# Altium schematic sheet DE11.SchDoc
size A3; SheetNumber: 1; SheetTotal: 1; SPICEModelCacheJDXTLVBZ: <root> / <DocumentId>JDXTLVBZ</DocumentId> / <CacheFrame Number="0"> / <Model Name="diode" Kind="MDL"> / <Text>*Default Diode / *Diode Pinout: A,K / .MODEL DIODE D()</Text> / </Model> / <Model Name="skydiode" Kind="MDL"> / <Text>*Default Schottky Diode / *Schottky Diode Pinout: A,K / .MODEL SKYDIODE D(EG=0.69 XTI=2)</Text> / </Model> / <Model Name="fuse" Kind="CKT"> / <Text>.SUBCKT FUSE 1 2 PARAMS: CURRENT=1 RESISTANCE=1m / SW1 1 2 3 0 SMOD OFF / BNLV 3 0 V=(abs(v(1,2))) / .MODEL SMOD SW (VT={(CURRENT*RESISTANCE)} RON=1g ROFF={RESISTANCE}) / .ENDS FUSE</Text> / </Model> / <Model Name="ideal3w" Kind="CKT"> / <Text>* Ideal Transformer Subcircuit Parameters / * RATIO1 = turns ratio (= secondary1/primary) / * RATIO2 = turns ratio (= secondary2/primary) / * / * Ideal Transformer with three windings / * jjt 18/12/00: created using IDEAL4W (created by dw, 18/12/2000) as a template. / * Connections: / *               Pri+ / *               | Pri- / *               | | Sec1+ / *               | | | Sec1- / *               | | | | Sec2+ / *               | | | | | Sec2- / *               | | | | | | / *               | | | | | | / *               | | | | | | / .SUBCKT IDEAL3W 1 2 3 4 5 6 PARAMS: RATIO1=1 RATIO2=1 / BP  1 2 I=( -I(BS1)*{RATIO1} - I(BS2)*{RATIO2} ) / BS1 3 4 V=( V(1,2)*{RATIO1} ) / BS2 5 6 V=( V(1,2)*{RATIO2} ) / .ENDS IDEAL3W</Text> / </Model> / <Model Name="irf9510" Kind="CKT"> / <Text>*IRF9510  MCE  4-2-96 / *100V  4A  1.2 ohms HEXFET pkg:TO-220 2,1,3 / .SUBCKT IRF9510  10 20 40 40 / M1   1  2  3  3  DMOS L=1U W=1U / RD  10  1  .569 / RS  30  3  31M / RG  20  2  37.5 / CGS  2  3  182P / EGD 12  0  1  2  1 / VFB 14  0  0 / FFB  1  2  VFB  1 / CGD 13 14  231P / R1  13  0  1 / D1  12 13  DLIM / DDG 15 14  DCGD / R2  12 15  1 / D2  15  0  DLIM / DSD 10  3  DSUB / LS  30 40  7.5N / .MODEL DMOS PMOS (LEVEL=3 THETA=60M VMAX=208K ETA=2M VTO=-3 KP=.471) / .MODEL DCGD D (CJO=231P VJ=.6 M=.68) / .MODEL DSUB D (IS=16.6N N=1.5 RS=1.18 BV=100 CJO=327P VJ=.8 M=.42 TT=82N) / .MODEL DLIM D (IS=100U) / .ENDS IRF9510</Text> / </Model> / <Model Name="irf1010" Kind="CKT"> / <Text>*IRF1010 MCE 4-2-96 / *55V  75A .014 ohm HEXFET pkg:TO-220 2,1,3 / .SUBCKT IRF1010  10 20 40 40 / M1   1  2  3  3  DMOS L=1U W=1U / RD  10  1  5.65M / RS  30  3  1.35M / RG  20  2  12.1 / CGS  2  3  2.15N / EGD 12  0  2  1  1 / VFB 14  0  0 / FFB  2  1  VFB  1 / CGD 13 14  4.49N / R1  13  0  1 / D1  12 13  DLIM / DDG 15 14  DCGD / R2  12 15  1 / D2  15  0  DLIM / DSD  3 10  DSUB / LS  30 40  7.5N / .MODEL DMOS NMOS (LEVEL=3 THETA=60M VMAX=114K ETA=2M VTO=3 KP=19.4) / .MODEL DCGD D (CJO=4.49N VJ=.6 M=.68) / .MODEL DSUB D (IS=311N N=1.5 RS=8.67M BV=55 CJO=4.08N VJ=.8 M=.42 TT=100N) / .MODEL DLIM D (IS=100U) / .ENDS IRF1010</Text> / </Model> / <Model Name="put" Kind="CKT"> / <Text>*Default Programable Unijunction Transistor pkg: TO-92 / *Connections: / *           Anode / *           | Gate / *           | | Cathode / *           | | | / .SUBCKT PUT 1 2 3 / Q1 2 4 3 NMOD / Q2 4 2 1 PMOD / .MODEL NMOD NPN() / .MODEL PMOD PNP() / .ENDS PUT</Text> / </Model> / </CacheFrame> / </root>
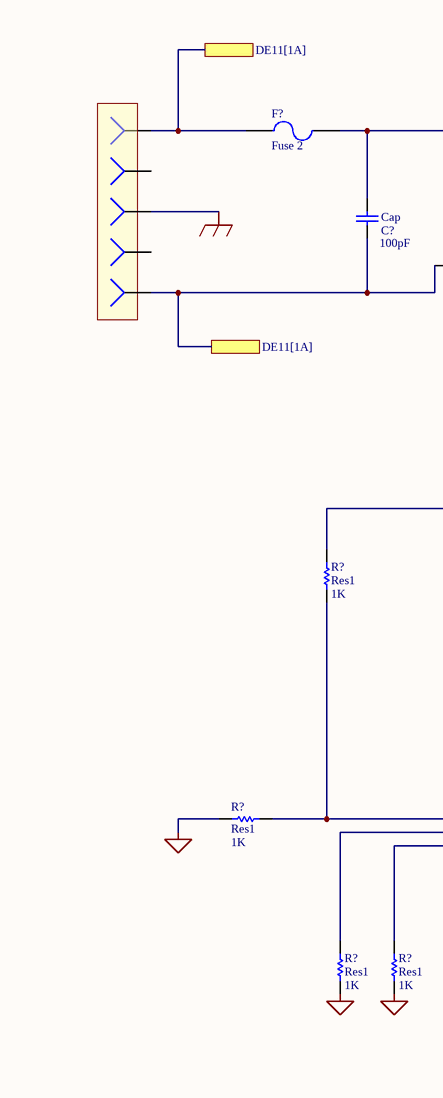
[diagram p0: DE11.SchDoc, left]
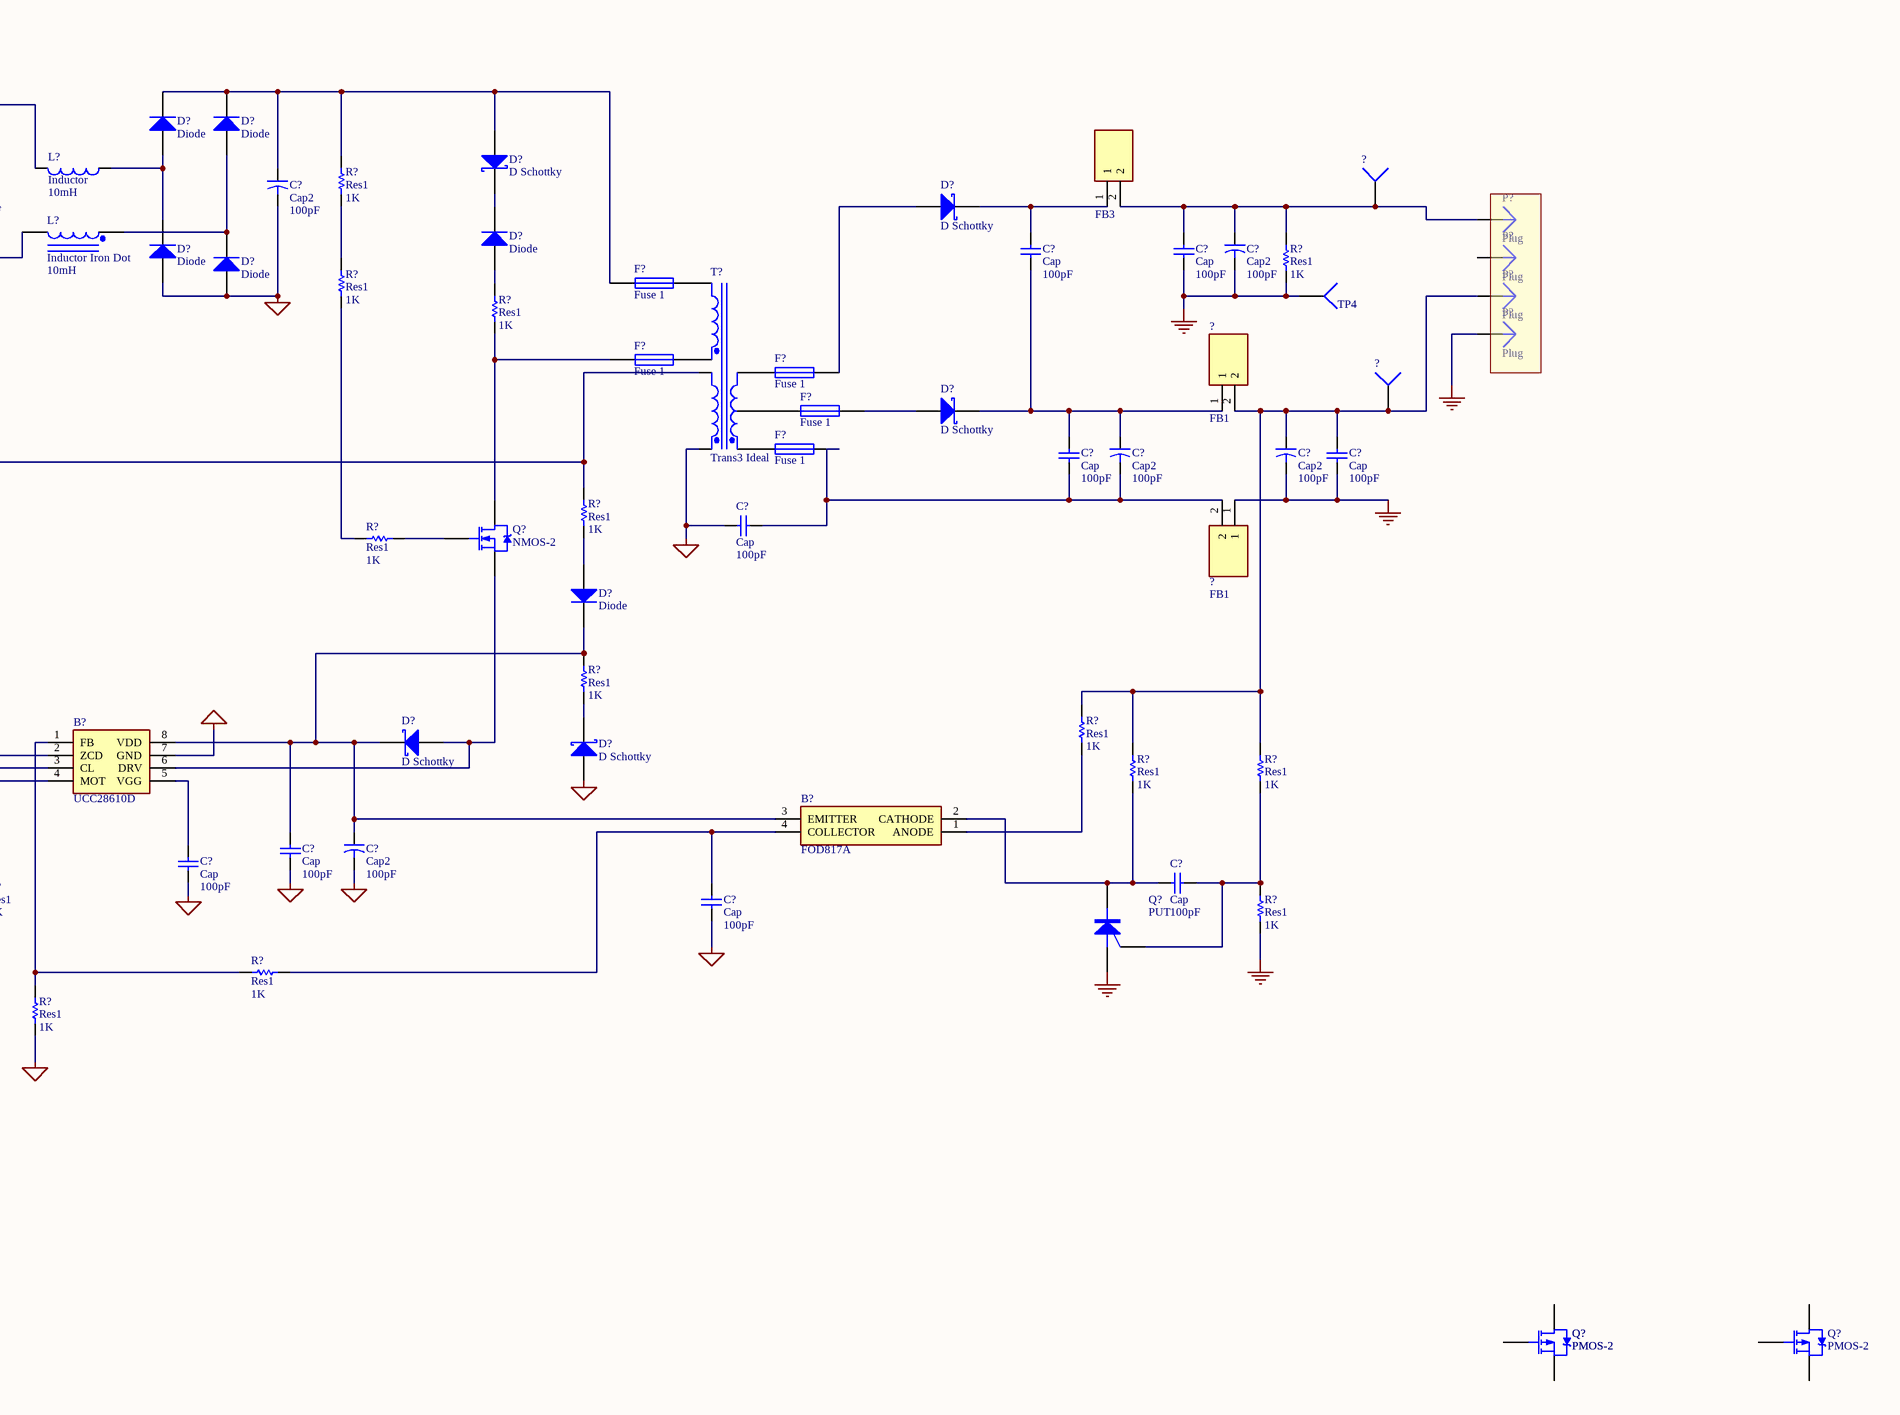
[diagram p1: DE11.SchDoc, right]

## Parts
(Parts that share a designator on the sheet are numbered #1, #2 ... from top to bottom, then left to right.)
?#1  (no value)  [PIN1]
?#2  (no value)  [PIN1]
?#3  (no value)  [PIN1]
?#4  (no value)  [PIN1]
?#5  (no value)  [PIN1]
?#6  FB3  [BLM18SP221SN1B]
?#7  (no value)  [PIN1]
?#8  (no value)  [PIN1]
?#9  FB1  [BLM18SP221SN1B]
?#10  FB1  [BLM18SP221SN1B]
B?#1  UCC28610D  [SOIC127P600X175-8N]
B?#2  FOD817A  [DIP762W60P254L460H440Q4N]
C?#1  Cap2  value 100pF  [CAPR5-4X5]
C?#2  Cap  value 100pF  [RAD-0.3]
C?#3  Cap2  value 100pF  [CAPR5-4X5]
C?#4  Cap  value 100pF  [RAD-0.3]
C?#5  Cap  value 100pF  [RAD-0.3]
C?#6  Cap2  value 100pF  [CAPR5-4X5]
C?#7  Cap2  value 100pF  [CAPR5-4X5]
C?#8  Cap  value 100pF  [RAD-0.3]
C?#9  Cap  value 100pF  [RAD-0.3]
C?#10  Cap  value 100pF  [RAD-0.3]
C?#11  Cap2  value 100pF  [CAPR5-4X5]
C?#12  Cap  value 100pF  [RAD-0.3]
C?#13  Cap  value 100pF  [RAD-0.3]
C?#14  Cap  value 100pF  [RAD-0.3]
C?#15  Cap  value 100pF  [RAD-0.3]
D?#1  Diode  [SMC]
D?#2  Diode  [SMC]
D?#3  D Schottky  [SMB]
D?#4  D Schottky  [SMB]
D?#5  Diode  [SMC]
D?#6  Diode  [SMC]
D?#7  Diode  [SMC]
D?#8  D Schottky  [SMB]
D?#9  Diode  [SMC]
D?#10  D Schottky  [SMB]
D?#11  D Schottky  [SMB]
F?#1  Fuse 2  [PIN-W2/E2.8]
F?#2  Fuse 1  [PIN-W2/E2.8]
F?#3  Fuse 1  [PIN-W2/E2.8]
F?#4  Fuse 1  [PIN-W2/E2.8]
F?#5  Fuse 1  [PIN-W2/E2.8]
F?#6  Fuse 1  [PIN-W2/E2.8]
L?#1  Inductor  value 10mH  [0402-A]
L?#2  Inductor Iron Dot  value 10mH  [DIODE_SMC]
P?#1  Plug  [PIN1]
P?#2  Plug  [PIN1]
P?#3  Plug  [PIN1]
P?#4  Plug  [PIN1]
Q?#1  NMOS-2  [TO-220AB]
Q?#2  PUT  [TO-52]
Q?#3  PMOS-2  [TO-220AB]
Q?#4  PMOS-2  [TO-220AB]
Q?#5  PMOS-2  [TO-220AB]
R?#1  Res1  value 1K  [AXIAL-0.3]
R?#2  Res1  value 1K  [AXIAL-0.3]
R?#3  Res1  value 1K  [AXIAL-0.3]
R?#4  Res1  value 1K  [AXIAL-0.3]
R?#5  Res1  value 1K  [AXIAL-0.3]
R?#6  Res1  value 1K  [AXIAL-0.3]
R?#7  Res1  value 1K  [AXIAL-0.3]
R?#8  Res1  value 1K  [AXIAL-0.3]
R?#9  Res1  value 1K  [AXIAL-0.3]
R?#10  Res1  value 1K  [AXIAL-0.3]
R?#11  Res1  value 1K  [AXIAL-0.3]
R?#12  Res1  value 1K  [AXIAL-0.3]
R?#13  Res1  value 1K  [AXIAL-0.3]
R?#14  Res1  value 1K  [AXIAL-0.3]
R?#15  Res1  value 1K  [AXIAL-0.3]
R?#16  Res1  value 1K  [AXIAL-0.3]
R?#17  Res1  value 1K  [AXIAL-0.3]
T?  Trans3 Ideal  [TRF_6]
TP4  (no value)  [PIN1]

## Ports
 (see DE11[1A])

## Nets
Net?#3_1: ?#3.1 ?#10.1 B?#1.7(GND) C?#1.2 C?#3.2 C?#5.1 C?#7.2 C?#9.1 C?#10.1 C?#11.2 C?#12.1 C?#13.1 C?#15.1 D?#6.1(A) D?#7.1(A) D?#11.1(A) P?#4.1 Q?#2.1(A) R?#2.1 R?#9.1 R?#13.1 R?#14.1 R?#15.1 R?#17.1 T?.3(Sec1+) TP4.1
Net?#1_1: ?#1.1 ?#7.1 C?#2.1 F?#1.1 L?#2.2 ; port 
Net?#4_1: ?#4.1 ?#6.2 C?#3.1 C?#5.2 P?#1.1 R?#2.2
Net?#6_1: ?#6.1 C?#4.2 D?#4.2(K)
Net?#8_1: ?#8.1 ?#9.2 C?#7.1 C?#9.2 P?#3.1 R?#10.2 R?#11.1 R?#12.2
Net?#9_1: ?#9.1 C?#4.1 C?#6.1 C?#8.2 D?#8.2(K)
Net?#10_2: ?#10.2 C?#6.2 C?#8.1 C?#10.2 F?#6.2
NetB?#1_1: B?#1.1(FB) R?#16.1 R?#17.2
NetB?#1_2: B?#1.2(ZCD) R?#7.1 R?#9.2
NetB?#1_3: B?#1.3(CL) R?#13.2
NetB?#1_4: B?#1.4(MOT) R?#14.2
NetB?#1_5: B?#1.5(VGG) C?#13.2
NetB?#1_6: B?#1.6(DRV) D?#10.1(A) Q?#1.3(S)
NetB?#1_8: B?#1.8(VDD) B?#2.3(EMITTER) C?#11.1 C?#12.2 D?#9.2(K) D?#10.2(K) R?#8.2
NetB?#2_1: B?#2.1(ANODE) R?#10.1
NetB?#2_2: B?#2.2(CATHODE) C?#14.2 Q?#2.3(K) R?#11.2
NetB?#2_4: B?#2.4(COLLECTOR) C?#15.2 R?#16.2
NetC?#1_1: C?#1.1 D?#1.2(K) D?#2.2(K) D?#3.1(A) F?#2.1 R?#1.2
NetC?#2_2: C?#2.2 F?#1.2 L?#1.2
NetC?#14_1: C?#14.1 Q?#2.2(G) R?#12.1 R?#15.2
NetD?#1_1: D?#1.1(A) D?#6.2(K) L?#1.1
NetD?#2_1: D?#2.1(A) D?#7.2(K) L?#2.1
NetD?#3_2: D?#3.2(K) D?#5.2(K)
NetD?#4_1: D?#4.1(A) F?#4.2
NetD?#5_1: D?#5.1(A) R?#4.2
NetD?#8_1: D?#8.1(A) F?#5.2
NetD?#9_1: D?#9.1(A) R?#6.1
NetD?#11_2: D?#11.2(K) R?#8.1
NetF?#2_2: F?#2.2 T?.6(Sec2-)
NetF?#3_1: F?#3.1 Q?#1.2(D) R?#4.1
NetF?#3_2: F?#3.2 T?.5(Sec2+)
NetF?#4_1: F?#4.1 T?.2(Pri-)
NetF?#5_1: F?#5.1 T?.7(Pri)
NetF?#6_1: F?#6.1 T?.1(Pri+)
NetQ?#1_1: Q?#1.1(G) R?#5.2
NetQ?#3_1: Q?#3.1(G) Q?#4.1(G)
NetQ?#3_2: Q?#3.2(D) Q?#4.2(D)
NetQ?#3_3: Q?#3.3(S) Q?#4.3(S)
NetR?#1_1: R?#1.1 R?#3.2
NetR?#3_1: R?#3.1 R?#5.1
NetR?#6_2: R?#6.2 R?#7.2 T?.4(Sec1-)

Not connected (* = marked no-connect by the designer): ?#2 1; ?#5 1; P?#2 1; Q?#5 1(G) 2(D) 3(S)

## Library data of the parts
?#1-?#5 ?#7 ?#8 TP4 = Socket: LatestRevisionDate: 17-Jul-2002; LatestRevisionNote: Re-released for DXP Platform.; Publisher: Altium Limited
?#6 ?#9 ?#10 = BLM18AG121SN1: Ferrite Beads; Manufacturer_Name: Murata Electronics; Geometry.Height: 0.95mm; Manufacturer_Part_Number: BLM18AG121SN1; Mouser Part Number: N/A; Mouser Price/Stock: https://www.mouser.co.uk/ProductDetail/Murata-Electronics/BLM18AG121SN1?qs=%2F7R%2FnUXKGojxL2k8G%252BVKUA%3D%3D; Arrow Part Number: *; Arrow Price/Stock: *; Datasheet Link: http://www.murata.com/~/media/webrenewal/support/library/catalog/products/emc/emifil/c31e.ashx?la=en-gb
B?#1 = UCC28610D: Texas Instruments UCC28610D, Buck Controller, - 5  +1.5 A, 130 kHz, 9  20 V, 8-Pin SOIC; Geometry.Height: 1.75mm; Manufacturer_Name: Texas Instruments; Manufacturer_Part_Number: UCC28610D; Mouser Part Number: 595-UCC28610D; Mouser Price/Stock: https://www.mouser.com/Search/Refine.aspx?Keyword=595-UCC28610D; Arrow Part Number: UCC28610D; Arrow Price/Stock: https://www.arrow.com/en/products/ucc28610d/texas-instruments; Datasheet Link: http://www.ti.com/lit/gpn/UCC28610
B?#2 = FOD817A: Current Transfer Ratio in Selected Groups:; FOD814: 20-300%; FOD817B: 130-260%; Safety and Regulatory Approvals; FOD817C: 200-400%; FOD817A: 80-160%; UL1577, 5,000 VACRMS for 1 Minute; FOD817: 50-600%; Minimum BVCEO of 70 V Guaranteed; FOD814A: 50-150%; AC Input Response (FOD814); FOD817D: 300-600%; DIN EN/IEC60747-5-5; Manufacturer_Name: onsemi; Geometry.Height: 4.4mm; Manufacturer_Part_Number: FOD817A; Mouser Part Number: 512-FOD817A; Mouser Price/Stock: https://www.mouser.co.uk/ProductDetail/onsemi-Fairchild/FOD817A?qs=HbI%2FMOA3e17mlsfglyJ3Gw%3D%3D; Arrow Part Number: FOD817A; Arrow Price/Stock: null?region=asia; Datasheet Link: https://www.onsemi.com/pub/Collateral/FOD814-D.PDF
C?#1 C?#3 C?#6 C?#7 C?#11 = Cap2: Capacitor; Published: 23-Sep-2002; PackageReference: CAPR5-4X5; Publisher: Altium Limited; PackageDescription: Capacitor; 2 Leads
C?#2 C?#4 C?#5 C?#8-C?#10 C?#12-C?#15 = Cap: Capacitor; Published: 8-Jun-2000; LatestRevisionDate: 17-Jul-2002; LatestRevisionNote: Re-released for DXP Platform.; PackageReference: RAD-0.3; Publisher: Altium Limited; PackageDescription: Radial Cap, Thru-Hole; 2 Leads; 0.3 in Pin Spacing
D?#1 D?#2 D?#5-D?#7 D?#9 = Diode: Default Diode; Published: 8-Jun-2000; LatestRevisionDate: 17-Jul-2002; LatestRevisionNote: Re-released for DXP Platform.; PackageVersion: Sep-1996; PackageReference: SMC; Publisher: Altium Limited; PackageDescription: DO-214-AB/SMC; 2 C-Bend Leads; Body 7.9 x 5.9 mm, inc. leads (LxW); Code_JEDEC: DO-214-AB
D?#3 D?#4 D?#8 D?#10 D?#11 = D Schottky: Schottky Diode; Published: 8-Jun-2000; LatestRevisionDate: 17-Jul-2002; LatestRevisionNote: Re-released for DXP Platform.; PackageReference: SMB; Publisher: Altium Limited; PackageDescription: DO-214-AA/SMB; 2 C-Bend Leads; Body 5.3 x 3.6 mm, inc. leads (LxW); Code_JEDEC: DO-214-AA
F?#1 = Fuse 2: Fuse; Published: 8-Jun-2000; LatestRevisionDate: 17-Jul-2002; LatestRevisionNote: Re-released for DXP Platform.; PackageReference: PIN-W2/E2.8; Publisher: Altium Limited; PackageDescription: Thru-Hole; 2 Leads
F?#2-F?#6 = Fuse 1: Fuse; Published: 8-Jun-2000; LatestRevisionDate: 17-Jul-2002; LatestRevisionNote: Re-released for DXP Platform.; PackageReference: PIN-W2/E2.8; Publisher: Altium Limited; PackageDescription: Thru-Hole; 2 Leads
L?#1 = Inductor: Code_IEC: 1005; Published: 8-Jun-2000; LatestRevisionDate: 29-May-2009; LatestRevisionNote: IPC-7351 Footprint Added.; PackageReference: 0402-A; Publisher: Altium Limited; PackageDescription: Chip Inductor; Code_JEITA: 0402
L?#2 = Inductor Iron Dot: Magnetic-Core Inductor with Winding Polarity Marking; Published: 24-Mar-1999; LatestRevisionDate: 17-Jul-2002; LatestRevisionNote: Re-released for DXP Platform.; PackageReference: DIODE_SMC; Publisher: Altium Limited; PackageDescription: Diode; 2 Leads
Q?#1 = NMOS-2: N-Channel Power MOSFET; Note: Pin 2 is electrically connected to pin 4.; Published: 8-Jun-2000; LatestRevisionDate: 17-Jul-2002; LatestRevisionNote: Re-released for DXP Platform.; DatasheetVersion: PD-9.814; PackageVersion: Feb-1997; PackageReference: TO-220AB; Publisher: Altium Limited; PackageDescription: TO, Thru-Hole, Vertical, Heatsink Mounted; 3 In-Line Leads; Pitch 2.54 mm; ComponentLink1Description: Manufacturer Link; ComponentLink1URL: http://www.irf.com/
Q?#2 = PUT: Programmable Unijunction Transistor; Published: 8-Jun-2000; LatestRevisionDate: 17-Jul-2002; LatestRevisionNote: Re-released for DXP Platform.; PackageReference: TO-52; Publisher: Altium Limited; PackageDescription: Can; 3 Leads; Pin Circle Dia. 2.54 mm; Lead Dia. 0.48 mm (max)
Q?#3-Q?#5 = PMOS-2: P-Channel Power MOSFET; Note: Pin 4 not drawn and electrically connected to Pin 2.; Published: 8-Jun-2000; LatestRevisionDate: 17-Jul-2002; LatestRevisionNote: Re-released for DXP Platform.; DatasheetVersion: PD-9.390D; PackageVersion: Feb-1997; PackageReference: TO-220AB; Publisher: Altium Limited; PackageDescription: TO, Thru-Hole, Vertical, Heatsink Mounted; 3 In-Line Leads; Pitch 2.54 mm; ComponentLink1Description: Manufacturer Link; ComponentLink1URL: http://www.irf.com/
R?#1-R?#17 = Res1: Resistor; Published: 8-Jun-2000; LatestRevisionDate: 17-Jul-2002; LatestRevisionNote: Re-released for DXP Platform.; PackageReference: AXIAL-0.3; Publisher: Altium Limited; PackageDescription: Axial Device, Thru-Hole; 2 Leads; 0.3 in Pin Spacing
T? = Trans3 Ideal: Three-winding Transformer (Ideal); Published: 25-Jan-2001; LatestRevisionDate: 17-Jul-2002; LatestRevisionNote: Re-released for DXP Platform.; PackageReference: TRF_6; Publisher: Altium Limited; PackageDescription: Transformer; 6 Leads
P?#1-P?#4 = Plug: LatestRevisionDate: 17-Jul-2002; LatestRevisionNote: Re-released for DXP Platform.; Publisher: Altium Limited